# EAGLE schematic P1001-001-003-320 - Controller (EAGLE 9.4.2)

## Sheet 1 of 4
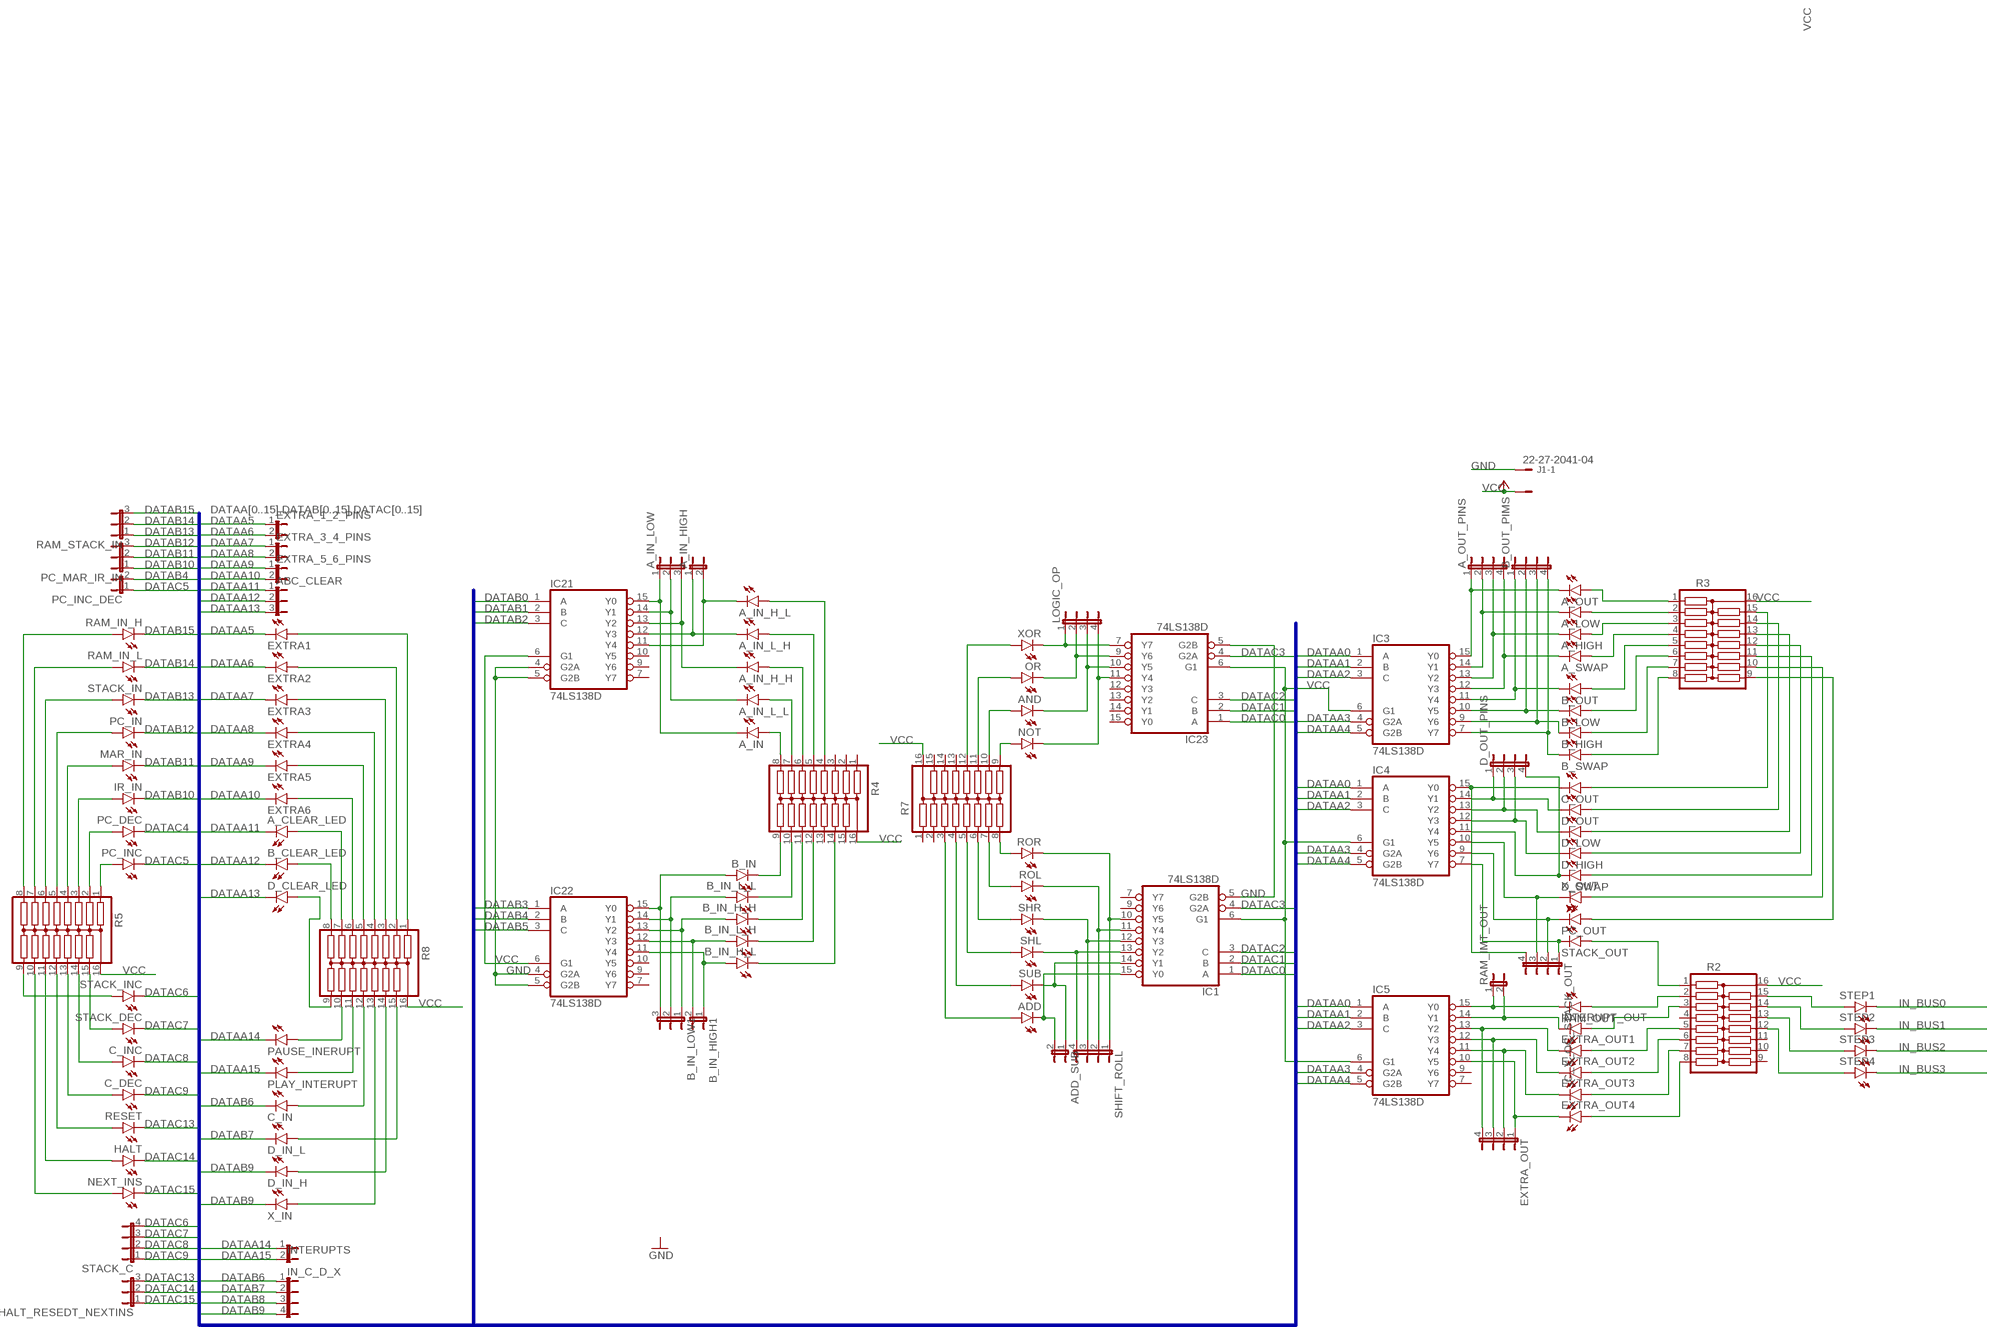
[diagram p0: schematic, sheet 1]

### Parts
A_CLEAR_LED  LEDSFH482  [SFH482]
A_HIGH  LEDSFH482  [SFH482]
A_IN  LEDSFH482  [SFH482]
A_IN_H_H  LEDSFH482  [SFH482]
A_IN_H_L  LEDSFH482  [SFH482]
A_IN_HIGH  JP1E  [JP1]
A_IN_L_H  LEDSFH482  [SFH482]
A_IN_L_L  LEDSFH482  [SFH482]
A_IN_LOW  JP2W  [JP2W]
A_LOW  LEDSFH482  [SFH482]
A_OUT  LEDSFH482  [SFH482]
A_OUT_PINS  JP4E  [JP4]
A_SWAP  LEDSFH482  [SFH482]
ABC_CLEAR  JP2W  [JP2W]
ADD  LEDSFH482  [SFH482]
ADD_SUB  JP1E  [JP1]
AND  LEDSFH482  [SFH482]
B_CLEAR_LED  LEDSFH482  [SFH482]
B_HIGH  LEDSFH482  [SFH482]
B_IN  LEDSFH482  [SFH482]
B_IN_H_H  LEDSFH482  [SFH482]
B_IN_H_L  LEDSFH482  [SFH482]
B_IN_HIGH1  JP1E  [JP1]
B_IN_L_H  LEDSFH482  [SFH482]
B_IN_L_L  LEDSFH482  [SFH482]
B_IN_LOW1  JP2W  [JP2W]
B_LOW  LEDSFH482  [SFH482]
B_OUT  LEDSFH482  [SFH482]
B_OUT_PIMS  JP4E  [JP4]
B_SWAP  LEDSFH482  [SFH482]
C_DEC  LEDSFH482  [SFH482]
C_IN  LEDSFH482  [SFH482]
C_INC  LEDSFH482  [SFH482]
C_OUT  LEDSFH482  [SFH482]
C_X_OC_STACK_OUT  JP4E  [JP4]
D_CLEAR_LED  LEDSFH482  [SFH482]
D_HIGH  LEDSFH482  [SFH482]
D_IN_H  LEDSFH482  [SFH482]
D_IN_L  LEDSFH482  [SFH482]
D_LOW  LEDSFH482  [SFH482]
D_OUT  LEDSFH482  [SFH482]
D_OUT_PINS  JP4E  [JP4]
D_SWAP  LEDSFH482  [SFH482]
EXTRA1  LEDSFH482  [SFH482]
EXTRA2  LEDSFH482  [SFH482]
EXTRA3  LEDSFH482  [SFH482]
EXTRA4  LEDSFH482  [SFH482]
EXTRA5  LEDSFH482  [SFH482]
EXTRA6  LEDSFH482  [SFH482]
EXTRA_1_2_PINS  JP1E  [JP1]
EXTRA_3_4_PINS  JP1E  [JP1]
EXTRA_5_6_PINS  JP1E  [JP1]
EXTRA_OUT  JP4E  [JP4]
EXTRA_OUT1  LEDSFH482  [SFH482]
EXTRA_OUT2  LEDSFH482  [SFH482]
EXTRA_OUT3  LEDSFH482  [SFH482]
EXTRA_OUT4  LEDSFH482  [SFH482]
HALT  LEDSFH482  [SFH482]
HALT_RESEDT_NEXTINS  JP2W  [JP2W]
IC1  74LS138D  [SO16]
IC3  74LS138D  [SO16]
IC4  74LS138D  [SO16]
IC5  74LS138D  [SO16]
IC21  74LS138D  [SO16]
IC22  74LS138D  [SO16]
IC23  74LS138D  [SO16]
IN_C_D_X  JP4E  [JP4]
INTERUPT_OUT  LEDSFH482  [SFH482]
INTERUPTS  JP1E  [JP1]
IR_IN  LEDSFH482  [SFH482]
J1  22-27-2041-04  [6410-04]
LOGIC_OP  JP4E  [JP4]
MAR_IN  LEDSFH482  [SFH482]
NEXT_INS  LEDSFH482  [SFH482]
NOT  LEDSFH482  [SFH482]
OR  LEDSFH482  [SFH482]
PAUSE_INERUPT  LEDSFH482  [SFH482]
PC_DEC  LEDSFH482  [SFH482]
PC_IN  LEDSFH482  [SFH482]
PC_INC  LEDSFH482  [SFH482]
PC_INC_DEC  JP1E  [JP1]
PC_MAR_IR_IN  JP2W  [JP2W]
PC_OUT  LEDSFH482  [SFH482]
PLAY_INTERUPT  LEDSFH482  [SFH482]
R2  2NBS16-15  [SO16]
R3  2NBS16-15  [SO16]
R4  2NBS16-15  [SO16]
R5  2NBS16-15  [SO16]
R7  2NBS16-15  [SO16]
R8  2NBS16-15  [SO16]
RAM_IMT_OUT  JP1E  [JP1]
RAM_IN_H  LEDSFH482  [SFH482]
RAM_IN_L  LEDSFH482  [SFH482]
RAM_OUT  LEDSFH482  [SFH482]
RAM_STACK_IN  JP2W  [JP2W]
RESET  LEDSFH482  [SFH482]
ROL  LEDSFH482  [SFH482]
ROR  LEDSFH482  [SFH482]
SHIFT_ROLL  JP4E  [JP4]
SHL  LEDSFH482  [SFH482]
SHR  LEDSFH482  [SFH482]
STACK_C  JP4E  [JP4]
STACK_DEC  LEDSFH482  [SFH482]
STACK_IN  LEDSFH482  [SFH482]
STACK_INC  LEDSFH482  [SFH482]
STACK_OUT  LEDSFH482  [SFH482]
STEP1  LEDSFH482  [SFH482]
STEP2  LEDSFH482  [SFH482]
STEP3  LEDSFH482  [SFH482]
STEP4  LEDSFH482  [SFH482]
SUB  LEDSFH482  [SFH482]
X_IN  LEDSFH482  [SFH482]
X_OUT  LEDSFH482  [SFH482]
XOR  LEDSFH482  [SFH482]

### Nets
DATAA0: IC3.1(A) IC4.1(A) IC5.1(A) ; also sheet 2,3
DATAA1: IC3.2(B) IC4.2(B) IC5.2(B) ; also sheet 2,3
DATAA2: IC3.3(C) IC4.3(C) IC5.3(C) ; also sheet 2,3
DATAA3: IC3.4(G2A) IC4.4(G2A) IC5.4(G2A) ; also sheet 2,3
DATAA4: IC3.5(G2B) IC4.5(G2B) IC5.5(G2B) ; also sheet 2,3
DATAA5: EXTRA1.K(C) EXTRA_1_2_PINS.1 ; also sheet 2,3
DATAA6: EXTRA2.K(C) EXTRA_1_2_PINS.2 ; also sheet 2,3
DATAA7: EXTRA3.K(C) EXTRA_3_4_PINS.1 ; also sheet 2,3
DATAA8: EXTRA4.K(C) EXTRA_3_4_PINS.2 ; also sheet 2,3
DATAA9: EXTRA5.K(C) EXTRA_5_6_PINS.1 ; also sheet 2,3
DATAA10: EXTRA6.K(C) EXTRA_5_6_PINS.2 ; also sheet 2,3
DATAA11: A_CLEAR_LED.K(C) ABC_CLEAR.1 ; also sheet 2,3
DATAA12: ABC_CLEAR.2 B_CLEAR_LED.K(C) ; also sheet 2,3
DATAA13: ABC_CLEAR.3 D_CLEAR_LED.K(C) ; also sheet 2,3
DATAA14: INTERUPTS.1 PAUSE_INERUPT.K(C) ; also sheet 2,3
DATAA15: INTERUPTS.2 PLAY_INTERUPT.K(C) ; also sheet 2,3
DATAB0: IC21.1(A) ; also sheet 2,3
DATAB1: IC21.2(B) ; also sheet 2,3
DATAB2: IC21.3(C) ; also sheet 2,3
DATAB3: IC22.1(A) ; also sheet 2,3
DATAB4: IC22.2(B) PC_INC_DEC.2 ; also sheet 2,3
DATAB5: IC22.3(C) ; also sheet 2,3
DATAB6: C_IN.K(C) IN_C_D_X.1 ; also sheet 2,3
DATAB7: D_IN_L.K(C) IN_C_D_X.2 ; also sheet 2,3
DATAB8: D_IN_H.K(C) IN_C_D_X.3 ; also sheet 2,3
DATAB9: IN_C_D_X.4 X_IN.K(C) ; also sheet 2,3
DATAB10: IR_IN.K(C) PC_MAR_IR_IN.1 ; also sheet 2,3
DATAB11: MAR_IN.K(C) PC_MAR_IR_IN.2 ; also sheet 2,3
DATAB12: PC_IN.K(C) PC_MAR_IR_IN.3 ; also sheet 2,3
DATAB13: RAM_STACK_IN.1 STACK_IN.K(C) ; also sheet 2,3
DATAB14: RAM_IN_L.K(C) RAM_STACK_IN.2 ; also sheet 2,3
DATAB15: RAM_IN_H.K(C) RAM_STACK_IN.3 ; also sheet 2,3
DATAC0: IC1.1(A) IC23.1(A) ; also sheet 2,3
DATAC1: IC1.2(B) IC23.2(B) ; also sheet 2,3
DATAC2: IC1.3(C) IC23.3(C) ; also sheet 2,3
DATAC3: IC1.4(G2A) IC23.4(G2A) ; also sheet 2,3
DATAC4: PC_DEC.K(C) ; also sheet 2,3
DATAC5: PC_INC.K(C) PC_INC_DEC.1 ; also sheet 2,3
DATAC6: STACK_C.4 STACK_INC.K(C) ; also sheet 2,3
DATAC7: STACK_C.3 STACK_DEC.K(C) ; also sheet 2,3
DATAC8: C_INC.K(C) STACK_C.2 ; also sheet 2,3
DATAC9: C_DEC.K(C) STACK_C.1 ; also sheet 2,3
DATAC13: HALT_RESEDT_NEXTINS.3 RESET.K(C) ; also sheet 2,3
DATAC14: HALT.K(C) HALT_RESEDT_NEXTINS.2 ; also sheet 2,3
DATAC15: HALT_RESEDT_NEXTINS.1 NEXT_INS.K(C) ; also sheet 2,3
GND [power]: IC1.5(G2B) IC21.4(G2A) IC21.5(G2B) IC22.4(G2A) IC22.5(G2B) IC23.5(G2B) J1.1 ; also sheet 2,3,4
IN_BUS0: STEP1.K(C) ; also sheet 2,3
IN_BUS1: STEP2.K(C) ; also sheet 2,3
IN_BUS2: STEP3.K(C) ; also sheet 2,3
IN_BUS3: STEP4.K(C) ; also sheet 2,3
N$2: EXTRA1.A R8.1
N$3: EXTRA2.A R8.2
N$4: R8.13 X_IN.A
N$5: EXTRA4.A R8.4
N$6: EXTRA3.A R8.3
N$7: EXTRA6.A R8.6
N$8: B_CLEAR_LED.A R8.8
N$9: A_CLEAR_LED.A R8.7
N$10: D_CLEAR_LED.A R8.9
N$11: PAUSE_INERUPT.A R8.10
N$12: PLAY_INTERUPT.A R8.11
N$13: C_IN.A R8.12
N$14: D_IN_L.A R8.15
N$15: D_IN_H.A R8.14
N$16: PC_INC.A R5.1
N$17: PC_DEC.A R5.2
N$18: IR_IN.A R5.3
N$19: MAR_IN.A R5.4
N$20: PC_IN.A R5.5
N$21: R5.6 STACK_IN.A
N$22: R5.7 RAM_IN_L.A
N$23: R5.8 RAM_IN_H.A
N$24: NEXT_INS.A R5.10
N$25: R5.15 STACK_DEC.A
N$26: C_INC.A R5.14
N$27: C_DEC.A R5.13
N$28: R5.12 RESET.A
N$29: HALT.A R5.11
N$30: R5.9 STACK_INC.A
N$31: A_IN.K(C) A_IN_LOW.1 IC21.15(Y0)
N$32: A_IN_L_L.K(C) A_IN_LOW.2 IC21.14(Y1)
N$33: A_IN_H_H.K(C) A_IN_LOW.3 IC21.13(Y2)
N$34: A_IN_HIGH.1 A_IN_L_H.K(C) IC21.12(Y3)
N$35: A_IN_H_L.K(C) A_IN_HIGH.2 IC21.11(Y4)
N$36: A_IN.A R4.8
N$38: A_IN_L_L.A R4.7
N$39: A_IN_H_H.A R4.6
N$40: A_IN_L_H.A R4.5
N$41: A_IN_H_L.A R4.4
N$43: EXTRA5.A R8.5
N$44: B_IN.A B_IN_LOW1.3 IC22.15(Y0)
N$45: B_IN_L_L.A B_IN_LOW1.2 IC22.14(Y1)
N$46: B_IN_H_H.A B_IN_LOW1.1 IC22.13(Y2)
N$47: B_IN_HIGH1.2 B_IN_L_H.A IC22.12(Y3)
N$48: B_IN_H_L.A B_IN_HIGH1.1 IC22.11(Y4)
N$49: B_IN.K(C) R4.9
N$51: B_IN_L_L.K(C) R4.10
N$52: B_IN_H_H.K(C) R4.11
N$53: B_IN_L_H.K(C) R4.12
N$54: B_IN_H_L.K(C) R4.14
N$55: R7.8 ROR.A
N$56: R7.7 ROL.A
N$57: R7.6 SHR.A
N$58: R7.5 SHL.A
N$59: R7.4 SUB.A
N$60: ADD.A R7.3
N$61: ADD.K(C) ADD_SUB.2 IC1.15(Y0)
N$62: ADD_SUB.1 IC1.14(Y1) SUB.K(C)
N$63: IC1.13(Y2) SHIFT_ROLL.4 SHL.K(C)
N$64: IC1.12(Y3) SHIFT_ROLL.3 SHR.K(C)
N$65: IC1.11(Y4) ROL.K(C) SHIFT_ROLL.2
N$66: IC1.10(Y5) ROR.K(C) SHIFT_ROLL.1
N$67: NOT.A R7.9
N$68: AND.A R7.10
N$69: OR.A R7.11
N$70: R7.12 XOR.A
N$71: IC23.7(Y7) LOGIC_OP.1 XOR.K(C)
N$72: IC23.9(Y6) LOGIC_OP.2 OR.K(C)
N$73: AND.K(C) IC23.10(Y5) LOGIC_OP.3
N$74: IC23.11(Y4) LOGIC_OP.4 NOT.K(C)
N$75: A_OUT.K(C) A_OUT_PINS.1 IC3.15(Y0)
N$76: A_LOW.K(C) A_OUT_PINS.2 IC3.14(Y1)
N$77: A_HIGH.K(C) A_OUT_PINS.3 IC3.13(Y2)
N$78: A_OUT_PINS.4 A_SWAP.K(C) IC3.12(Y3)
N$79: B_OUT.K(C) B_OUT_PIMS.1 IC3.11(Y4)
N$80: B_LOW.K(C) B_OUT_PIMS.2 IC3.10(Y5)
N$81: B_HIGH.K(C) B_OUT_PIMS.3 IC3.9(Y6)
N$82: B_OUT_PIMS.4 B_SWAP.K(C) IC3.7(Y7)
N$83: D_OUT.K(C) D_OUT_PINS.1 IC4.14(Y1)
N$84: C_OUT.K(C) C_X_OC_STACK_OUT.4 IC4.15(Y0)
N$85: D_LOW.K(C) D_OUT_PINS.2 IC4.13(Y2)
N$86: D_HIGH.K(C) D_OUT_PINS.3 IC4.12(Y3)
N$87: D_OUT_PINS.4 D_SWAP.K(C) IC4.11(Y4)
N$88: C_X_OC_STACK_OUT.3 IC4.10(Y5) X_OUT.K(C)
N$89: C_X_OC_STACK_OUT.2 IC4.9(Y6) PC_OUT.K(C)
N$90: C_X_OC_STACK_OUT.1 IC4.7(Y7) STACK_OUT.K(C)
N$91: A_OUT.A R3.1
N$92: A_LOW.A R3.2
N$93: A_HIGH.A R3.3
N$94: A_SWAP.A R3.4
N$95: B_OUT.A R3.5
N$96: B_LOW.A R3.6
N$97: B_HIGH.A R3.7
N$98: B_SWAP.A R3.8
N$99: C_OUT.A R3.15
N$100: D_OUT.A R3.14
N$101: D_LOW.A R3.13
N$102: D_HIGH.A R3.12
N$103: D_SWAP.A R3.11
N$104: R3.10 X_OUT.A
N$105: PC_OUT.A R3.9
N$106: IC5.15(Y0) RAM_IMT_OUT.1 RAM_OUT.K(C)
N$107: IC5.14(Y1) INTERUPT_OUT.K(C) RAM_IMT_OUT.2
N$108: EXTRA_OUT1.K(C) EXTRA_OUT.4 IC5.13(Y2)
N$109: EXTRA_OUT2.K(C) EXTRA_OUT.3 IC5.12(Y3)
N$110: EXTRA_OUT3.K(C) EXTRA_OUT.2 IC5.11(Y4)
N$111: EXTRA_OUT4.K(C) EXTRA_OUT.1 IC5.10(Y5)
N$112: R2.1 STACK_OUT.A
N$113: EXTRA_OUT4.A R2.8
N$114: EXTRA_OUT3.A R2.7
N$115: EXTRA_OUT2.A R2.6
N$116: EXTRA_OUT1.A R2.5
N$117: R2.2 RAM_OUT.A
N$118: INTERUPT_OUT.A R2.3
N$131: R2.15 STEP1.A
N$132: R2.14 STEP2.A
N$133: R2.13 STEP3.A
N$134: R2.12 STEP4.A
VCC [power]: IC1.6(G1) IC3.6(G1) IC4.6(G1) IC5.6(G1) IC21.6(G1) IC22.6(G1) IC23.6(G1) J1.2 R2.16 R3.16 R4.16 R5.16 R7.16 R8.16 ; also sheet 2,3,4
Unconnected: IC1.7(Y7) IC1.9(Y6) IC5.7(Y7) IC5.9(Y6) IC21.7(Y7) IC21.9(Y6) IC21.10(Y5) IC22.7(Y7) IC22.9(Y6) IC22.10(Y5) IC23.12(Y3) IC23.13(Y2) IC23.14(Y1) IC23.15(Y0) J1.3 J1.4 R2.4 R2.9 R2.10 R2.11 R4.1 R4.2 R4.3 R4.13 R4.15 R7.1 R7.2 R7.13 R7.14 R7.15

### Buses
DATAA[0..15],DATAB[0..15],DATAC[0..15]

## Sheet 2 of 4
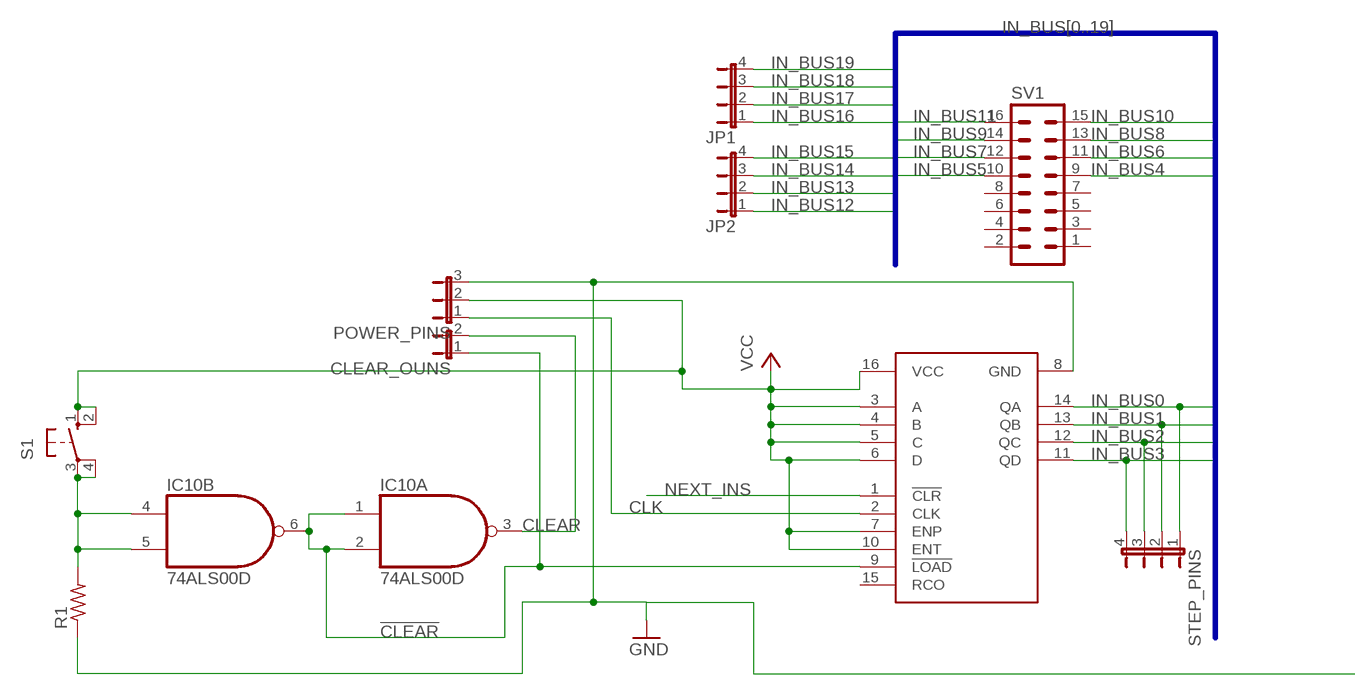
[diagram p1: schematic, sheet 2, part 1 of 2]
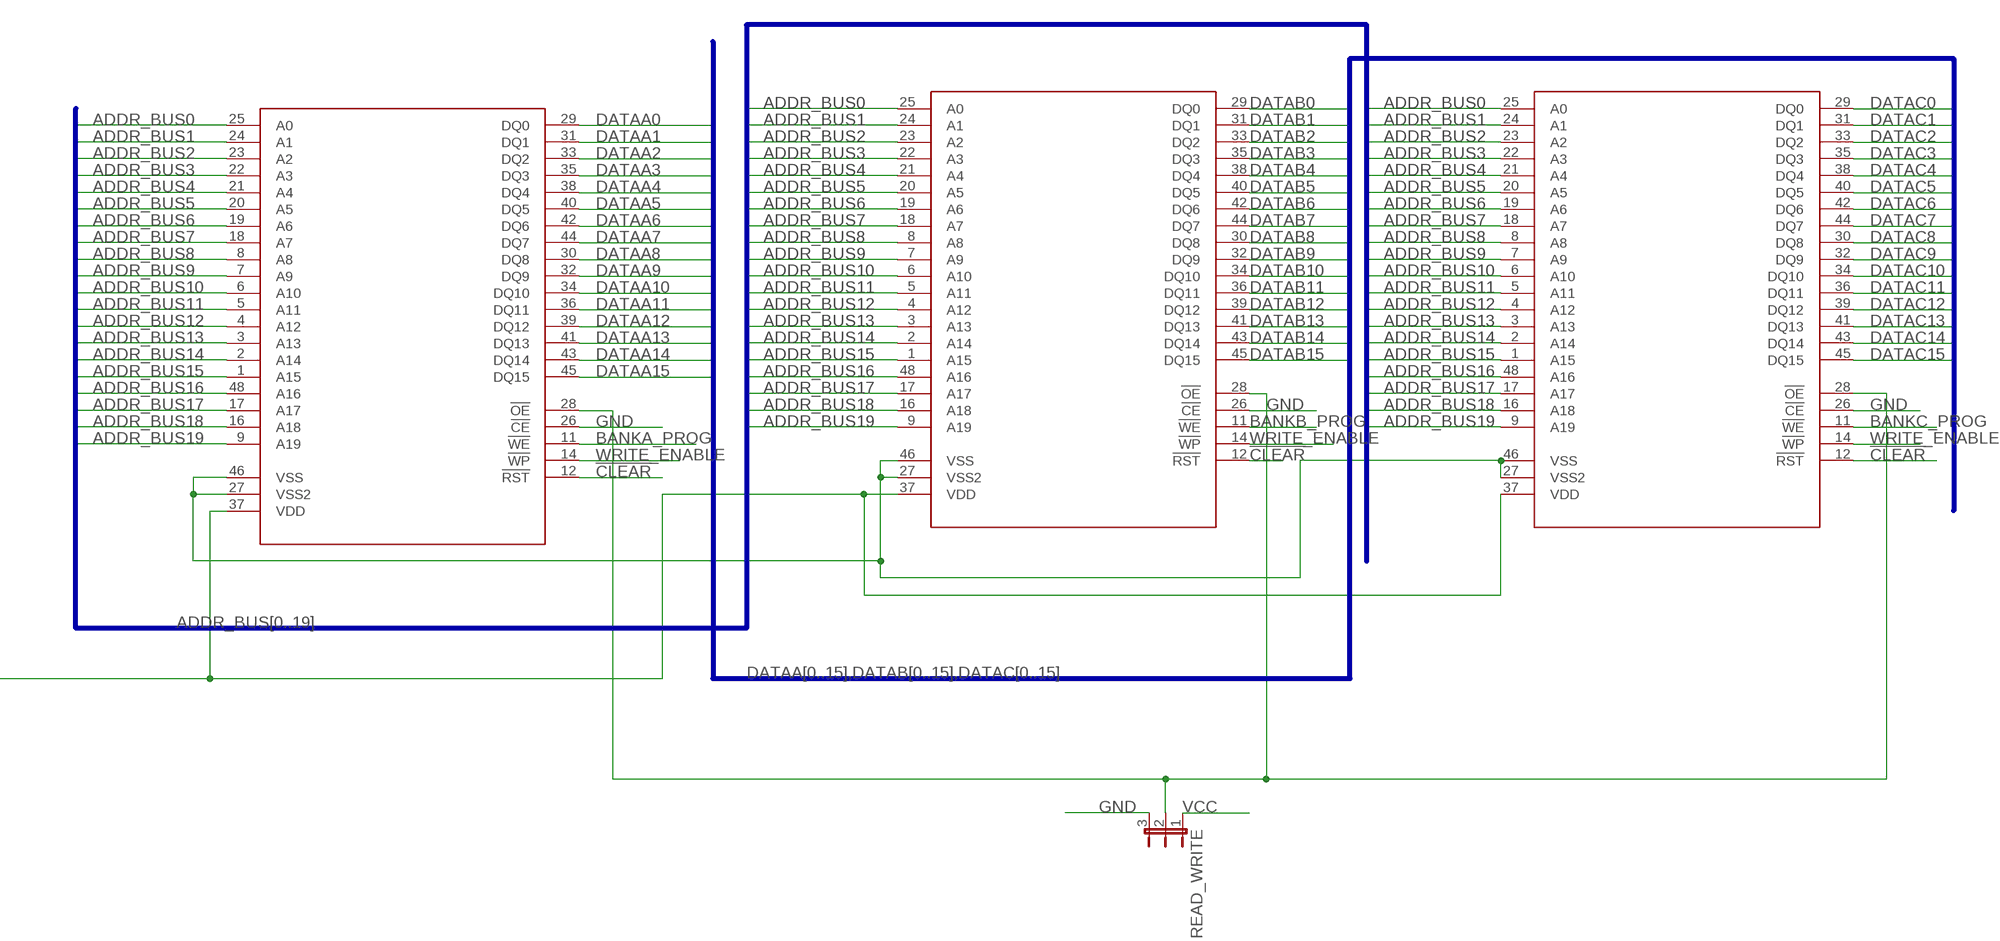
[diagram p2: schematic, sheet 2, part 2 of 2]

### Parts
BANKA  SST39VF1602-70-4I-EKE  [TSOP48]
BANKB  SST39VF1602-70-4I-EKE  [TSOP48]
BANKC  SST39VF1602-70-4I-EKE  [TSOP48]
CLEAR_OUNS  JP1E  [JP1]
IC10  74ALS00D  [SO14]
JP1  JP4E  [JP4]
JP2  JP4E  [JP4]
POWER_PINS  JP2E  [JP2]
R1  R-US_M0805  [M0805]
READ_WRITE  JP2E  [JP2]
S1  40-XX  [B3F-40XX]
STEP_PINS  JP4E  [JP4]
SV1  ML16  [ML16]
U$4  SN74HC161  [SO16]

### Nets
!CLEAR: BANKA.12(!RST) BANKB.12(!RST) BANKC.12(!RST) CLEAR_OUNS.1 IC10.1(A:I0) IC10.2(A:I1) IC10.6(B:O) U$4.9(!LOAD)
ADDR_BUS0: BANKA.25(A0) BANKB.25(A0) BANKC.25(A0) ; also sheet 3
ADDR_BUS1: BANKA.24(A1) BANKB.24(A1) BANKC.24(A1) ; also sheet 3
ADDR_BUS2: BANKA.23(A2) BANKB.23(A2) BANKC.23(A2) ; also sheet 3
ADDR_BUS3: BANKA.22(A3) BANKB.22(A3) BANKC.22(A3) ; also sheet 3
ADDR_BUS4: BANKA.21(A4) BANKB.21(A4) BANKC.21(A4) ; also sheet 3
ADDR_BUS5: BANKA.20(A5) BANKB.20(A5) BANKC.20(A5) ; also sheet 3
ADDR_BUS6: BANKA.19(A6) BANKB.19(A6) BANKC.19(A6) ; also sheet 3
ADDR_BUS7: BANKA.18(A7) BANKB.18(A7) BANKC.18(A7) ; also sheet 3
ADDR_BUS8: BANKA.8(A8) BANKB.8(A8) BANKC.8(A8) ; also sheet 3
ADDR_BUS9: BANKA.7(A9) BANKB.7(A9) BANKC.7(A9) ; also sheet 3
ADDR_BUS10: BANKA.6(A10) BANKB.6(A10) BANKC.6(A10) ; also sheet 3
ADDR_BUS11: BANKA.5(A11) BANKB.5(A11) BANKC.5(A11) ; also sheet 3
ADDR_BUS12: BANKA.4(A12) BANKB.4(A12) BANKC.4(A12) ; also sheet 3
ADDR_BUS13: BANKA.3(A13) BANKB.3(A13) BANKC.3(A13) ; also sheet 3
ADDR_BUS14: BANKA.2(A14) BANKB.2(A14) BANKC.2(A14) ; also sheet 3
ADDR_BUS15: BANKA.1(A15) BANKB.1(A15) BANKC.1(A15) ; also sheet 3
ADDR_BUS16: BANKA.48(A16) BANKB.48(A16) BANKC.48(A16) ; also sheet 3
ADDR_BUS17: BANKA.17(A17) BANKB.17(A17) BANKC.17(A17) ; also sheet 3
ADDR_BUS18: BANKA.16(A18) BANKB.16(A18) BANKC.16(A18) ; also sheet 3
ADDR_BUS19: BANKA.9(A19) BANKB.9(A19) BANKC.9(A19) ; also sheet 3
BANKA_PROG: BANKA.11(!WE) ; also sheet 3
BANKB_PROG: BANKB.11(!WE) ; also sheet 3
BANKC_PROG: BANKC.11(!WE) ; also sheet 3
CLEAR: CLEAR_OUNS.2 IC10.3(A:O)
CLK: POWER_PINS.1 U$4.2(CLK)
DATAA0: BANKA.29(DQ0) ; also sheet 1,3
DATAA1: BANKA.31(DQ1) ; also sheet 1,3
DATAA2: BANKA.33(DQ2) ; also sheet 1,3
DATAA3: BANKA.35(DQ3) ; also sheet 1,3
DATAA4: BANKA.38(DQ4) ; also sheet 1,3
DATAA5: BANKA.40(DQ5) ; also sheet 1,3
DATAA6: BANKA.42(DQ6) ; also sheet 1,3
DATAA7: BANKA.44(DQ7) ; also sheet 1,3
DATAA8: BANKA.30(DQ8) ; also sheet 1,3
DATAA9: BANKA.32(DQ9) ; also sheet 1,3
DATAA10: BANKA.34(DQ10) ; also sheet 1,3
DATAA11: BANKA.36(DQ11) ; also sheet 1,3
DATAA12: BANKA.39(DQ12) ; also sheet 1,3
DATAA13: BANKA.41(DQ13) ; also sheet 1,3
DATAA14: BANKA.43(DQ14) ; also sheet 1,3
DATAA15: BANKA.45(DQ15) ; also sheet 1,3
DATAB0: BANKB.29(DQ0) ; also sheet 1,3
DATAB1: BANKB.31(DQ1) ; also sheet 1,3
DATAB2: BANKB.33(DQ2) ; also sheet 1,3
DATAB3: BANKB.35(DQ3) ; also sheet 1,3
DATAB4: BANKB.38(DQ4) ; also sheet 1,3
DATAB5: BANKB.40(DQ5) ; also sheet 1,3
DATAB6: BANKB.42(DQ6) ; also sheet 1,3
DATAB7: BANKB.44(DQ7) ; also sheet 1,3
DATAB8: BANKB.30(DQ8) ; also sheet 1,3
DATAB9: BANKB.32(DQ9) ; also sheet 1,3
DATAB10: BANKB.34(DQ10) ; also sheet 1,3
DATAB11: BANKB.36(DQ11) ; also sheet 1,3
DATAB12: BANKB.39(DQ12) ; also sheet 1,3
DATAB13: BANKB.41(DQ13) ; also sheet 1,3
DATAB14: BANKB.43(DQ14) ; also sheet 1,3
DATAB15: BANKB.45(DQ15) ; also sheet 1,3
DATAC0: BANKC.29(DQ0) ; also sheet 1,3
DATAC1: BANKC.31(DQ1) ; also sheet 1,3
DATAC2: BANKC.33(DQ2) ; also sheet 1,3
DATAC3: BANKC.35(DQ3) ; also sheet 1,3
DATAC4: BANKC.38(DQ4) ; also sheet 1,3
DATAC5: BANKC.40(DQ5) ; also sheet 1,3
DATAC6: BANKC.42(DQ6) ; also sheet 1,3
DATAC7: BANKC.44(DQ7) ; also sheet 1,3
DATAC8: BANKC.30(DQ8) ; also sheet 1,3
DATAC9: BANKC.32(DQ9) ; also sheet 1,3
DATAC10: BANKC.34(DQ10) ; also sheet 3
DATAC11: BANKC.36(DQ11) ; also sheet 3
DATAC12: BANKC.39(DQ12) ; also sheet 3
DATAC13: BANKC.41(DQ13) ; also sheet 1,3
DATAC14: BANKC.43(DQ14) ; also sheet 1,3
DATAC15: BANKC.45(DQ15) ; also sheet 1,3
GND [power]: BANKA.26(!CE) BANKA.37(VDD) BANKB.26(!CE) BANKB.37(VDD) BANKC.26(!CE) BANKC.37(VDD) POWER_PINS.3 R1.1 READ_WRITE.3 U$4.8(GND) ; also sheet 1,3,4
IN_BUS0: STEP_PINS.1 U$4.14(QA) ; also sheet 1,3
IN_BUS1: STEP_PINS.2 U$4.13(QB) ; also sheet 1,3
IN_BUS2: STEP_PINS.3 U$4.12(QC) ; also sheet 1,3
IN_BUS3: STEP_PINS.4 U$4.11(QD) ; also sheet 1,3
IN_BUS4: SV1.9 ; also sheet 3
IN_BUS5: SV1.10 ; also sheet 3
IN_BUS6: SV1.11 ; also sheet 3
IN_BUS7: SV1.12 ; also sheet 3
IN_BUS8: SV1.13 ; also sheet 3
IN_BUS9: SV1.14 ; also sheet 3
IN_BUS10: SV1.15 ; also sheet 3
IN_BUS11: SV1.16 ; also sheet 3
IN_BUS12: JP2.1 ; also sheet 3
IN_BUS13: JP2.2 ; also sheet 3
IN_BUS14: JP2.3 ; also sheet 3
IN_BUS15: JP2.4 ; also sheet 3
IN_BUS16: JP1.1 ; also sheet 3
IN_BUS17: JP1.2 ; also sheet 3
IN_BUS18: JP1.3 ; also sheet 3
IN_BUS19: JP1.4 ; also sheet 3
N$1: IC10.4(B:I0) IC10.5(B:I1) R1.2 S1.3(P) S1.4(P1)
N$37: BANKA.27(VSS2) BANKA.46(VSS) BANKB.27(VSS2) BANKB.46(VSS) BANKC.27(VSS2) BANKC.46(VSS)
N$42: BANKA.28(!OE) BANKB.28(!OE) BANKC.28(!OE) READ_WRITE.2
NEXT_INS: U$4.1(!CLR)
VCC [power]: POWER_PINS.2 READ_WRITE.1 S1.1(S) S1.2(S1) U$4.3(A) U$4.4(B) U$4.5(C) U$4.6(D) U$4.7(ENP) U$4.10(ENT) U$4.16(VCC) ; also sheet 1,3,4
WRITE_ENABLE: BANKA.14(!WP) BANKB.14(!WP) BANKC.14(!WP) ; also sheet 3
Unconnected: IC10.8(C:O) IC10.9(C:I0) IC10.10(C:I1) IC10.11(D:O) IC10.12(D:I0) IC10.13(D:I1) SV1.1 SV1.2 SV1.3 SV1.4 SV1.5 SV1.6 SV1.7 SV1.8 U$4.15(RCO)

### Buses
IN_BUS[0..19]
ADDR_BUS[0..19]
DATAA[0..15],DATAB[0..15],DATAC[0..15]

## Sheet 3 of 4
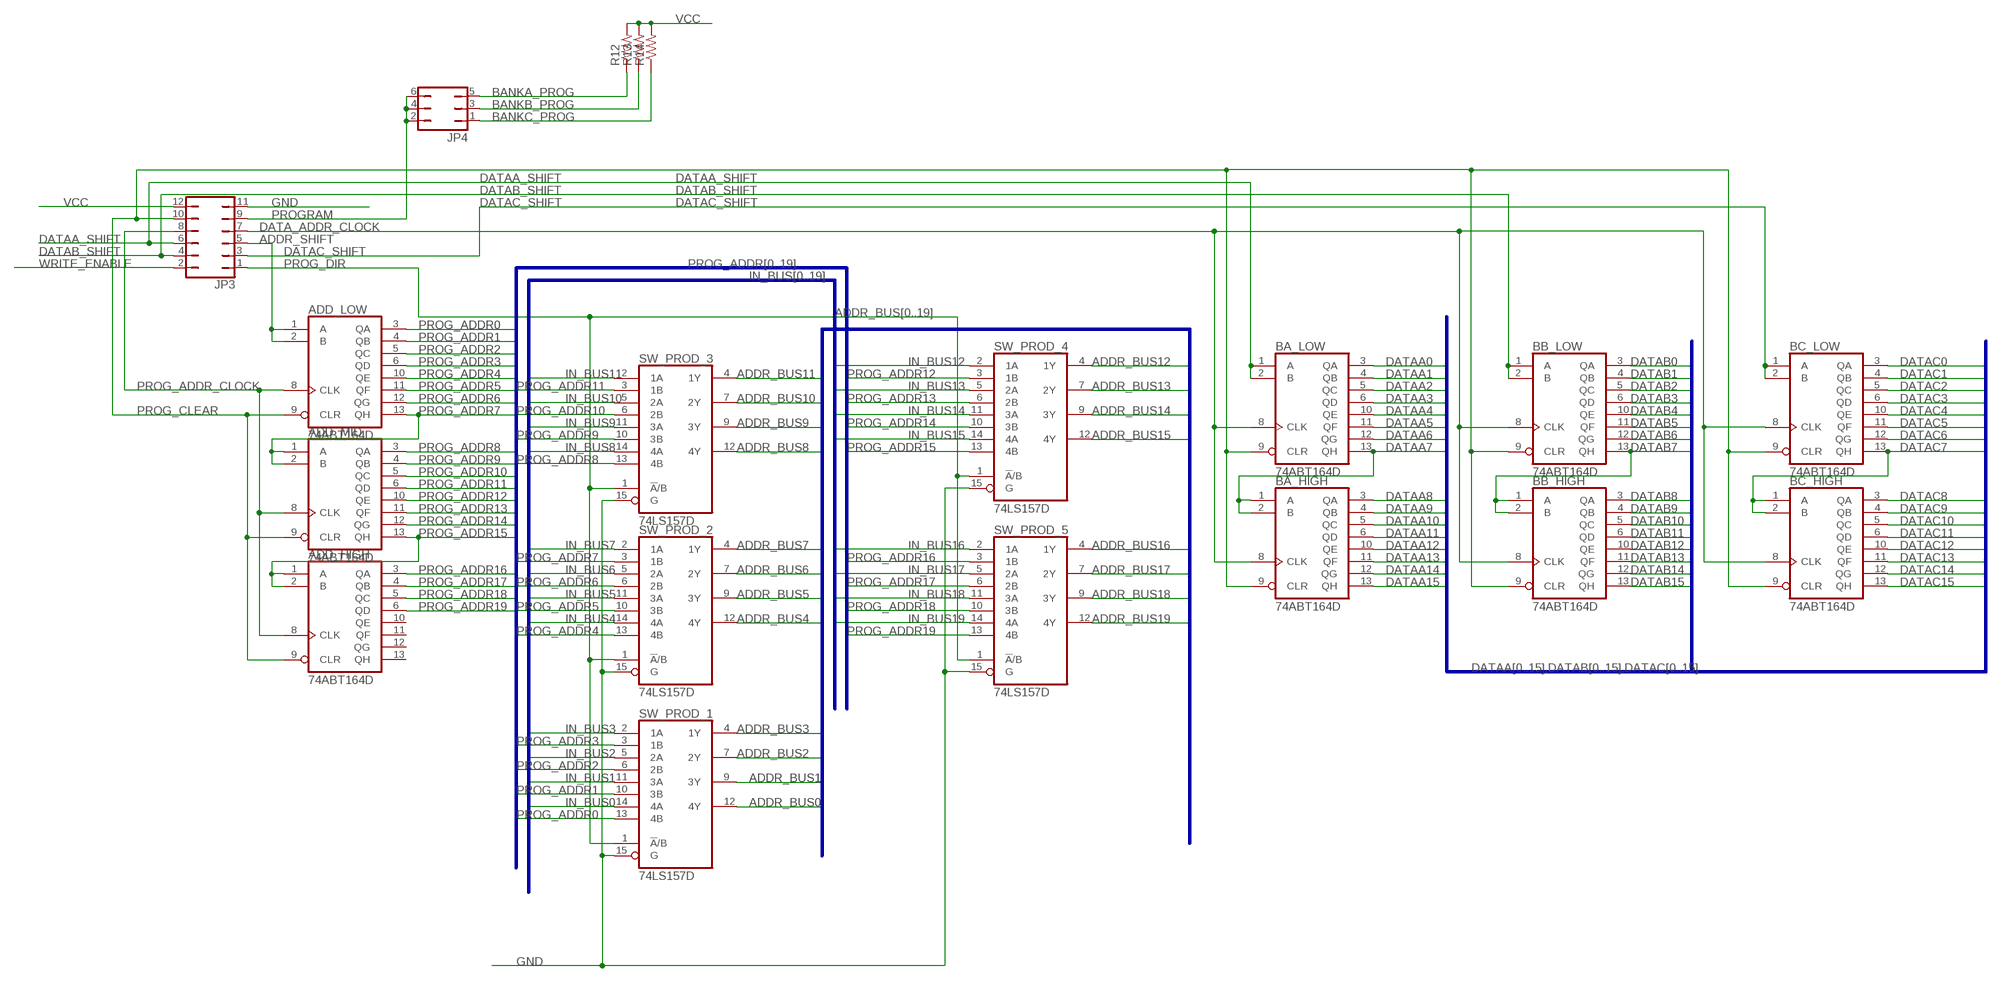
[diagram p3: schematic, sheet 3]

### Parts
ADD_HIGH  74ABT164D  [SO14]
ADD_LOW  74ABT164D  [SO14]
ADD_MID  74ABT164D  [SO14]
BA_HIGH  74ABT164D  [SO14]
BA_LOW  74ABT164D  [SO14]
BB_HIGH  74ABT164D  [SO14]
BB_LOW  74ABT164D  [SO14]
BC_HIGH  74ABT164D  [SO14]
BC_LOW  74ABT164D  [SO14]
JP3  JP6Q  [JP6Q]
JP4  JP3Q  [JP3Q]
R12  R-US_M0805  [M0805]
R13  R-US_M0805  [M0805]
R14  R-US_M0805  [M0805]
SW_PROD_1  74LS157D  [SO16]
SW_PROD_2  74LS157D  [SO16]
SW_PROD_3  74LS157D  [SO16]
SW_PROD_4  74LS157D  [SO16]
SW_PROD_5  74LS157D  [SO16]

### Nets
ADDR_BUS0: SW_PROD_1.12(4Y) ; also sheet 2
ADDR_BUS1: SW_PROD_1.9(3Y) ; also sheet 2
ADDR_BUS2: SW_PROD_1.7(2Y) ; also sheet 2
ADDR_BUS3: SW_PROD_1.4(1Y) ; also sheet 2
ADDR_BUS4: SW_PROD_2.12(4Y) ; also sheet 2
ADDR_BUS5: SW_PROD_2.9(3Y) ; also sheet 2
ADDR_BUS6: SW_PROD_2.7(2Y) ; also sheet 2
ADDR_BUS7: SW_PROD_2.4(1Y) ; also sheet 2
ADDR_BUS8: SW_PROD_3.12(4Y) ; also sheet 2
ADDR_BUS9: SW_PROD_3.9(3Y) ; also sheet 2
ADDR_BUS10: SW_PROD_3.7(2Y) ; also sheet 2
ADDR_BUS11: SW_PROD_3.4(1Y) ; also sheet 2
ADDR_BUS12: SW_PROD_4.4(1Y) ; also sheet 2
ADDR_BUS13: SW_PROD_4.7(2Y) ; also sheet 2
ADDR_BUS14: SW_PROD_4.9(3Y) ; also sheet 2
ADDR_BUS15: SW_PROD_4.12(4Y) ; also sheet 2
ADDR_BUS16: SW_PROD_5.4(1Y) ; also sheet 2
ADDR_BUS17: SW_PROD_5.7(2Y) ; also sheet 2
ADDR_BUS18: SW_PROD_5.9(3Y) ; also sheet 2
ADDR_BUS19: SW_PROD_5.12(4Y) ; also sheet 2
ADDR_SHIFT: ADD_LOW.1(A) ADD_LOW.2(B) JP3.5
BANKA_PROG: JP4.5 R12.1 ; also sheet 2
BANKB_PROG: JP4.3 R13.1 ; also sheet 2
BANKC_PROG: JP4.1 R14.1 ; also sheet 2
DATA_ADDR_CLOCK: BA_HIGH.8(CLK) BA_LOW.8(CLK) BB_HIGH.8(CLK) BB_LOW.8(CLK) BC_HIGH.8(CLK) BC_LOW.8(CLK) JP3.7
DATAA0: BA_LOW.3(QA) ; also sheet 1,2
DATAA1: BA_LOW.4(QB) ; also sheet 1,2
DATAA2: BA_LOW.5(QC) ; also sheet 1,2
DATAA3: BA_LOW.6(QD) ; also sheet 1,2
DATAA4: BA_LOW.10(QE) ; also sheet 1,2
DATAA5: BA_LOW.11(QF) ; also sheet 1,2
DATAA6: BA_LOW.12(QG) ; also sheet 1,2
DATAA7: BA_HIGH.1(A) BA_HIGH.2(B) BA_LOW.13(QH) ; also sheet 1,2
DATAA8: BA_HIGH.3(QA) ; also sheet 1,2
DATAA9: BA_HIGH.4(QB) ; also sheet 1,2
DATAA10: BA_HIGH.5(QC) ; also sheet 1,2
DATAA11: BA_HIGH.6(QD) ; also sheet 1,2
DATAA12: BA_HIGH.10(QE) ; also sheet 1,2
DATAA13: BA_HIGH.11(QF) ; also sheet 1,2
DATAA14: BA_HIGH.12(QG) ; also sheet 1,2
DATAA15: BA_HIGH.13(QH) ; also sheet 1,2
DATAA_SHIFT: BA_LOW.1(A) BA_LOW.2(B) JP3.6
DATAB0: BB_LOW.3(QA) ; also sheet 1,2
DATAB1: BB_LOW.4(QB) ; also sheet 1,2
DATAB2: BB_LOW.5(QC) ; also sheet 1,2
DATAB3: BB_LOW.6(QD) ; also sheet 1,2
DATAB4: BB_LOW.10(QE) ; also sheet 1,2
DATAB5: BB_LOW.11(QF) ; also sheet 1,2
DATAB6: BB_LOW.12(QG) ; also sheet 1,2
DATAB7: BB_HIGH.1(A) BB_HIGH.2(B) BB_LOW.13(QH) ; also sheet 1,2
DATAB8: BB_HIGH.3(QA) ; also sheet 1,2
DATAB9: BB_HIGH.4(QB) ; also sheet 1,2
DATAB10: BB_HIGH.5(QC) ; also sheet 1,2
DATAB11: BB_HIGH.6(QD) ; also sheet 1,2
DATAB12: BB_HIGH.10(QE) ; also sheet 1,2
DATAB13: BB_HIGH.11(QF) ; also sheet 1,2
DATAB14: BB_HIGH.12(QG) ; also sheet 1,2
DATAB15: BB_HIGH.13(QH) ; also sheet 1,2
DATAB_SHIFT: BB_LOW.1(A) BB_LOW.2(B) JP3.4
DATAC0: BC_LOW.3(QA) ; also sheet 1,2
DATAC1: BC_LOW.4(QB) ; also sheet 1,2
DATAC2: BC_LOW.5(QC) ; also sheet 1,2
DATAC3: BC_LOW.6(QD) ; also sheet 1,2
DATAC4: BC_LOW.10(QE) ; also sheet 1,2
DATAC5: BC_LOW.11(QF) ; also sheet 1,2
DATAC6: BC_LOW.12(QG) ; also sheet 1,2
DATAC7: BC_HIGH.1(A) BC_HIGH.2(B) BC_LOW.13(QH) ; also sheet 1,2
DATAC8: BC_HIGH.3(QA) ; also sheet 1,2
DATAC9: BC_HIGH.4(QB) ; also sheet 1,2
DATAC10: BC_HIGH.5(QC) ; also sheet 2
DATAC11: BC_HIGH.6(QD) ; also sheet 2
DATAC12: BC_HIGH.10(QE) ; also sheet 2
DATAC13: BC_HIGH.11(QF) ; also sheet 1,2
DATAC14: BC_HIGH.12(QG) ; also sheet 1,2
DATAC15: BC_HIGH.13(QH) ; also sheet 1,2
DATAC_SHIFT: BC_LOW.1(A) BC_LOW.2(B) JP3.3
GND [power]: JP3.11 SW_PROD_1.15(G) SW_PROD_2.15(G) SW_PROD_3.15(G) SW_PROD_4.15(G) SW_PROD_5.15(G) ; also sheet 1,2,4
IN_BUS0: SW_PROD_1.14(4A) ; also sheet 1,2
IN_BUS1: SW_PROD_1.11(3A) ; also sheet 1,2
IN_BUS2: SW_PROD_1.5(2A) ; also sheet 1,2
IN_BUS3: SW_PROD_1.2(1A) ; also sheet 1,2
IN_BUS4: SW_PROD_2.14(4A) ; also sheet 2
IN_BUS5: SW_PROD_2.11(3A) ; also sheet 2
IN_BUS6: SW_PROD_2.5(2A) ; also sheet 2
IN_BUS7: SW_PROD_2.2(1A) ; also sheet 2
IN_BUS8: SW_PROD_3.14(4A) ; also sheet 2
IN_BUS9: SW_PROD_3.11(3A) ; also sheet 2
IN_BUS10: SW_PROD_3.5(2A) ; also sheet 2
IN_BUS11: SW_PROD_3.2(1A) ; also sheet 2
IN_BUS12: SW_PROD_4.2(1A) ; also sheet 2
IN_BUS13: SW_PROD_4.5(2A) ; also sheet 2
IN_BUS14: SW_PROD_4.11(3A) ; also sheet 2
IN_BUS15: SW_PROD_4.14(4A) ; also sheet 2
IN_BUS16: SW_PROD_5.2(1A) ; also sheet 2
IN_BUS17: SW_PROD_5.5(2A) ; also sheet 2
IN_BUS18: SW_PROD_5.11(3A) ; also sheet 2
IN_BUS19: SW_PROD_5.14(4A) ; also sheet 2
PROG_ADDR0: ADD_LOW.3(QA) SW_PROD_1.13(4B)
PROG_ADDR1: ADD_LOW.4(QB) SW_PROD_1.10(3B)
PROG_ADDR2: ADD_LOW.5(QC) SW_PROD_1.6(2B)
PROG_ADDR3: ADD_LOW.6(QD) SW_PROD_1.3(1B)
PROG_ADDR4: ADD_LOW.10(QE) SW_PROD_2.13(4B)
PROG_ADDR5: ADD_LOW.11(QF) SW_PROD_2.10(3B)
PROG_ADDR6: ADD_LOW.12(QG) SW_PROD_2.6(2B)
PROG_ADDR7: ADD_LOW.13(QH) ADD_MID.1(A) ADD_MID.2(B) SW_PROD_2.3(1B)
PROG_ADDR8: ADD_MID.3(QA) SW_PROD_3.13(4B)
PROG_ADDR9: ADD_MID.4(QB) SW_PROD_3.10(3B)
PROG_ADDR10: ADD_MID.5(QC) SW_PROD_3.6(2B)
PROG_ADDR11: ADD_MID.6(QD) SW_PROD_3.3(1B)
PROG_ADDR12: ADD_MID.10(QE) SW_PROD_4.3(1B)
PROG_ADDR13: ADD_MID.11(QF) SW_PROD_4.6(2B)
PROG_ADDR14: ADD_MID.12(QG) SW_PROD_4.10(3B)
PROG_ADDR15: ADD_HIGH.1(A) ADD_HIGH.2(B) ADD_MID.13(QH) SW_PROD_4.13(4B)
PROG_ADDR16: ADD_HIGH.3(QA) SW_PROD_5.3(1B)
PROG_ADDR17: ADD_HIGH.4(QB) SW_PROD_5.6(2B)
PROG_ADDR18: ADD_HIGH.5(QC) SW_PROD_5.10(3B)
PROG_ADDR19: ADD_HIGH.6(QD) SW_PROD_5.13(4B)
PROG_ADDR_CLOCK: ADD_HIGH.8(CLK) ADD_LOW.8(CLK) ADD_MID.8(CLK) JP3.8
PROG_CLEAR: ADD_HIGH.9(CLR) ADD_LOW.9(CLR) ADD_MID.9(CLR) BA_HIGH.9(CLR) BA_LOW.9(CLR) BB_HIGH.9(CLR) BB_LOW.9(CLR) BC_HIGH.9(CLR) BC_LOW.9(CLR) JP3.10
PROG_DIR: JP3.1 SW_PROD_1.1(!A!/B) SW_PROD_2.1(!A!/B) SW_PROD_3.1(!A!/B) SW_PROD_4.1(!A!/B) SW_PROD_5.1(!A!/B)
PROGRAM: JP3.9 JP4.2 JP4.4 JP4.6
VCC [power]: JP3.12 R12.2 R13.2 R14.2 ; also sheet 1,2,4
WRITE_ENABLE: JP3.2 ; also sheet 2
Unconnected: ADD_HIGH.10(QE) ADD_HIGH.11(QF) ADD_HIGH.12(QG) ADD_HIGH.13(QH)

### Buses
ADDR_BUS[0..19]
IN_BUS[0..19]
PROG_ADDR[0..19]
DATAA[0..15],DATAB[0..15],DATAC[0..15]

## Sheet 4 of 4
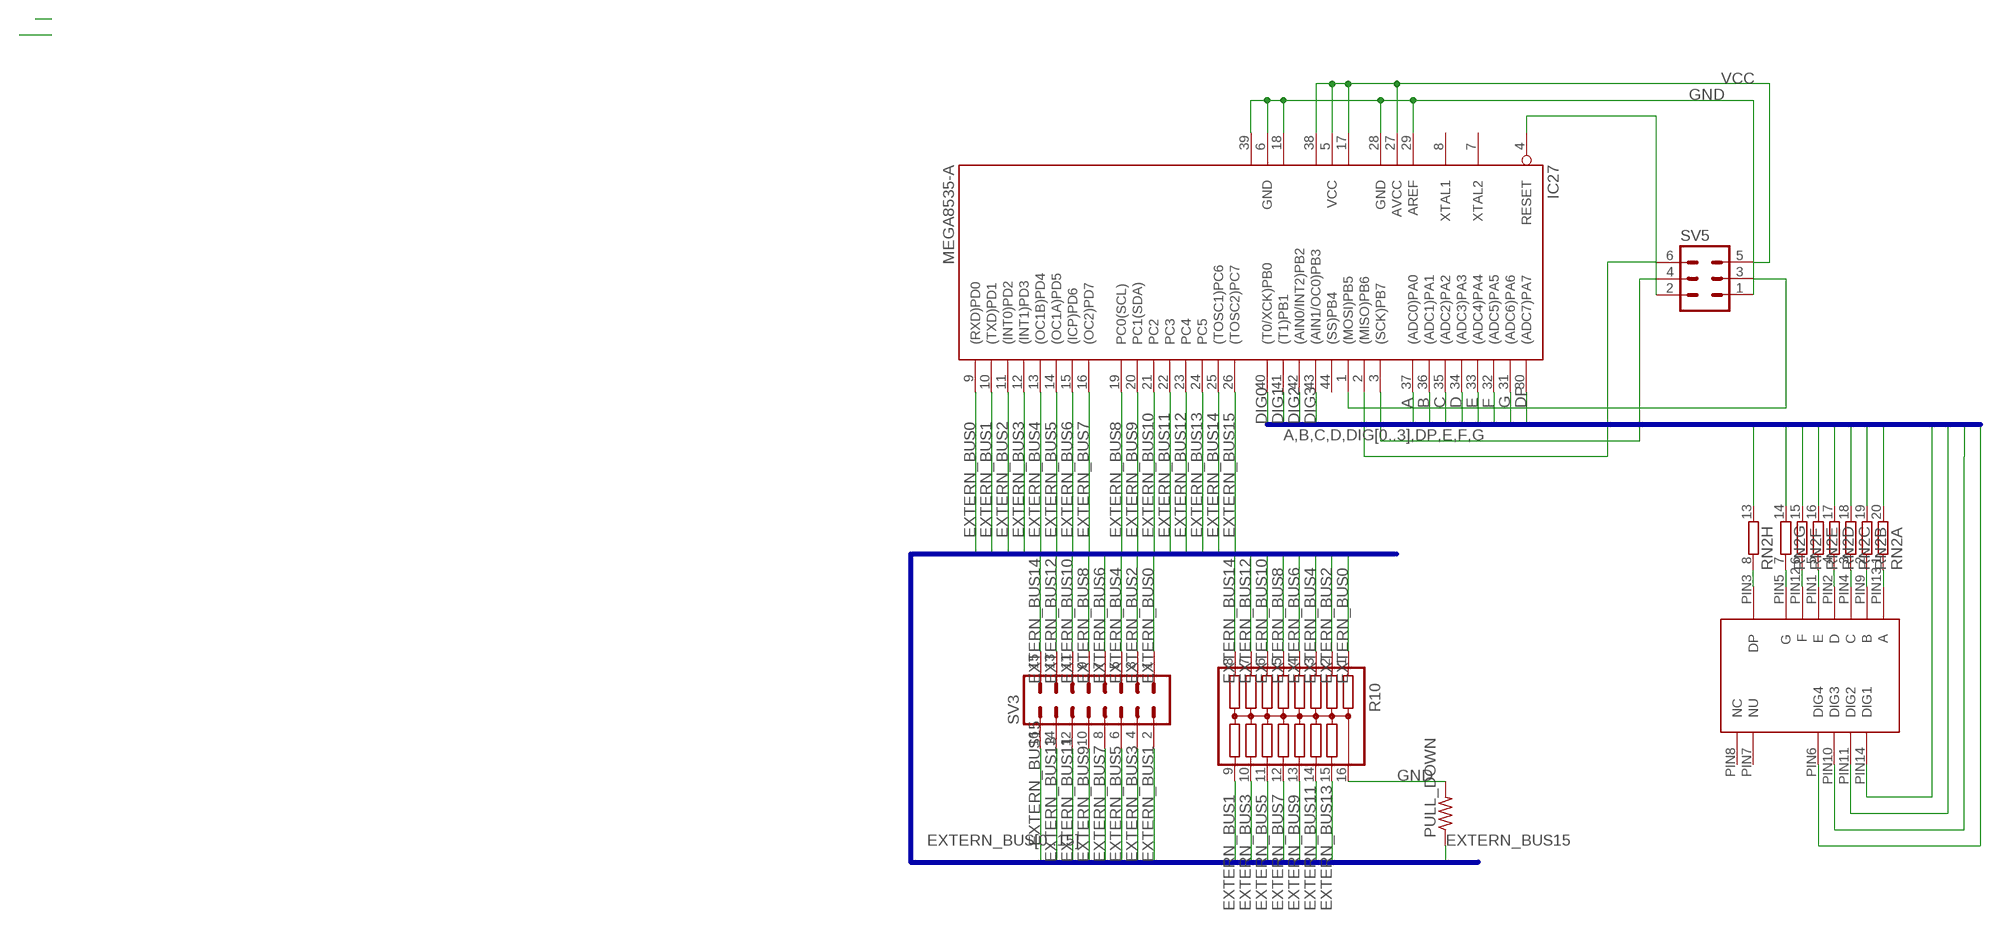
[diagram p4: schematic, sheet 4]

### Parts
IC27  MEGA8535-A  [TQFP44]
PULL_DOWN  R-US_M0805  [M0805]
R10  2NBS16-15  [SO16]
RN2  10R-NSOMC  [SOMC20]
SV3  ML16  [ML16]
SV5  ML6  [ML6]
U$1  4-DIGIT-7-SEGMENT  [4-DIGIT-7-SEGMENT]

### Nets
A: IC27.37((ADC0)PA0) RN2.20
B: IC27.36((ADC1)PA1) RN2.19
C: IC27.35((ADC2)PA2) RN2.18
D: IC27.34((ADC3)PA3) RN2.17
DIG0: IC27.40((T0/XCK)PB0) U$1.PIN14(DIG1)
DIG1: IC27.41((T1)PB1) U$1.PIN11(DIG2)
DIG2: IC27.42((AIN0/INT2)PB2) U$1.PIN10(DIG3)
DIG3: IC27.43((AIN1/OC0)PB3) U$1.PIN6(DIG4)
DP: IC27.30((ADC7)PA7) RN2.13
E: IC27.33((ADC4)PA4) RN2.16
EXTERN_BUS0: IC27.9((RXD)PD0) R10.1 SV3.1
EXTERN_BUS1: IC27.10((TXD)PD1) R10.9 SV3.2
EXTERN_BUS2: IC27.11((INT0)PD2) R10.2 SV3.3
EXTERN_BUS3: IC27.12((INT1)PD3) R10.10 SV3.4
EXTERN_BUS4: IC27.13((OC1B)PD4) R10.3 SV3.5
EXTERN_BUS5: IC27.14((OC1A)PD5) R10.11 SV3.6
EXTERN_BUS6: IC27.15((ICP)PD6) R10.4 SV3.7
EXTERN_BUS7: IC27.16((OC2)PD7) R10.12 SV3.8
EXTERN_BUS8: IC27.19(PC0(SCL)) R10.5 SV3.9
EXTERN_BUS9: IC27.20(PC1(SDA)) R10.13 SV3.10
EXTERN_BUS10: IC27.21(PC2) R10.6 SV3.11
EXTERN_BUS11: IC27.22(PC3) R10.14 SV3.12
EXTERN_BUS12: IC27.23(PC4) R10.7 SV3.13
EXTERN_BUS13: IC27.24(PC5) R10.15 SV3.14
EXTERN_BUS14: IC27.25((TOSC1)PC6) R10.8 SV3.15
EXTERN_BUS15: IC27.26((TOSC2)PC7) PULL_DOWN.1 SV3.16
F: IC27.32((ADC5)PA5) RN2.15
G: IC27.31((ADC6)PA6) RN2.14
GND [power]: IC27.6(GND) IC27.18(GND1) IC27.28(GND) IC27.29(AREF) IC27.39(GND2) PULL_DOWN.2 R10.16 SV5.1 ; also sheet 1,2,3
N$119: IC27.1((MOSI)PB5) SV5.3
N$120: IC27.3((SCK)PB7) SV5.4
N$121: IC27.2((MISO)PB6) SV5.6
N$122: IC27.4(RESET) SV5.2
N$123: RN2.1 U$1.PIN13(A)
N$124: RN2.2 U$1.PIN9(B)
N$125: RN2.3 U$1.PIN4(C)
N$126: RN2.4 U$1.PIN2(D)
N$127: RN2.5 U$1.PIN1(E)
N$128: RN2.6 U$1.PIN12(F)
N$129: RN2.7 U$1.PIN5(G)
N$130: RN2.8 U$1.PIN3(DP)
VCC [power]: IC27.5(VCC) IC27.17(VCC1) IC27.27(AVCC) IC27.38(VCC2) SV5.5 ; also sheet 1,2,3
Unconnected: IC27.7(XTAL2) IC27.8(XTAL1) IC27.44((SS)PB4) RN2.9 RN2.10 RN2.11 RN2.12 U$1.PIN7(NU) U$1.PIN8(NC)

### Buses
A,B,C,D,DIG[0..3],DP,E,F,G
EXTERN_BUS[0..15]

## Power pins joined to a net without a drawn wire
GND: ADD_HIGH.7(GND) ADD_LOW.7(GND) ADD_MID.7(GND) BA_HIGH.7(GND) BA_LOW.7(GND) BB_HIGH.7(GND) BB_LOW.7(GND) BC_HIGH.7(GND) BC_LOW.7(GND) IC1.8(GND) IC3.8(GND) IC4.8(GND) IC5.8(GND) IC10.7(P:GND) IC21.8(GND) IC22.8(GND) IC23.8(GND) SW_PROD_1.8(GND) SW_PROD_2.8(GND) SW_PROD_3.8(GND) SW_PROD_4.8(GND) SW_PROD_5.8(GND)
VCC: ADD_HIGH.14(VCC) ADD_LOW.14(VCC) ADD_MID.14(VCC) BA_HIGH.14(VCC) BA_LOW.14(VCC) BB_HIGH.14(VCC) BB_LOW.14(VCC) BC_HIGH.14(VCC) BC_LOW.14(VCC) IC1.16(VCC) IC3.16(VCC) IC4.16(VCC) IC5.16(VCC) IC10.14(P:VCC) IC21.16(VCC) IC22.16(VCC) IC23.16(VCC) SW_PROD_1.16(VCC) SW_PROD_2.16(VCC) SW_PROD_3.16(VCC) SW_PROD_4.16(VCC) SW_PROD_5.16(VCC)

## Library data of the parts
A_CLEAR_LED A_HIGH A_IN A_IN_H_H A_IN_H_L A_IN_L_H A_IN_L_L A_LOW A_OUT A_SWAP ADD AND B_CLEAR_LED B_HIGH B_IN B_IN_H_H B_IN_H_L B_IN_L_H B_IN_L_L B_LOW B_OUT B_SWAP C_DEC C_IN C_INC C_OUT D_CLEAR_LED D_HIGH D_IN_H D_IN_L D_LOW D_OUT D_SWAP EXTRA1-EXTRA6 EXTRA_OUT1-EXTRA_OUT4 HALT INTERUPT_OUT IR_IN MAR_IN NEXT_INS NOT OR PAUSE_INERUPT PC_DEC PC_IN PC_INC PC_OUT PLAY_INTERUPT RAM_IN_H RAM_IN_L RAM_OUT RESET ROL ROR SHL SHR STACK_DEC STACK_IN STACK_INC STACK_OUT STEP1-STEP4 SUB X_IN X_OUT XOR = led:LED: LED OSRAM: - CHIPLED LG R971, LG N971, LY N971, LG Q971, LY Q971, LO R971, LY R971 LH N974, LH R974 LS Q976, LO Q976, LY Q976 LO Q996 - Hyper CHIPLED LW Q18S LB Q993, LB Q99A, LB R99A - SideLED LS A670, LO A670, LY A670, LG A670, LP A670 LB A673, LV A673, LT A673, LW A673 LH A674 LY A675 LS A676, LA A676, LO A676, LY A676, LW A676 LS A679, LY A679, LG A679 - Hyper Micro SIDELED® LS Y876, LA Y876, LO Y876, LY Y876 LT Y87S - SmartLED LW L88C, LW L88S LB L89C, LB L89S, LG L890 LS L89K, LO L89K, LY L89K LS L896, LA L896, LO L896, LY L896 - TOPLED LS T670, LO T670, LY T670, LG T670, LP T670 LSG T670, LSP T670, LSY T670, LOP T670, LYG T670 LG T671, LOG T671, LSG T671 LB T673, LV T673, LT T673, LW T673 LH T674 LS T676, LA T676, LO T676, LY T676, LB T676, LH T676, LSB T676, LW T676 LB T67C, LV T67C, LT T67C, LS T67K, LO T67K, LY T67K, LW E67C LS E67B, LA E67B, LO E67B, LY E67B, LB E67C, LV E67C, LT E67C LW T67C LS T679, LY T679, LG T679 LS T770, LO T770, LY T770, LG T770, LP T770 LB T773, LV T773, LT T773, LW T773 LH T774 LS E675, LA E675, LY E675, LS T675 LS T776, LA T776, LO T776, LY T776, LB T776 LHGB T686 LT T68C, LB T68C - Hyper Mini TOPLED® LB M676 - Mini TOPLED Santana® LG M470 LS M47K, LO M47K, LY M47K Source: http://www.osram.convergy.de LUXEON: - LUMILED® LXK2-PW12-R00, LXK2-PW12-S00, LXK2-PW14-U00, LXK2-PW14-V00 LXK2-PM12-R00, LXK2-PM12-S00, LXK2-PM14-U00 LXK2-PE12-Q00, LXK2-PE12-R00, LXK2-PE12-S00, LXK2-PE14-T00, LXK2-PE14-U00 LXK2-PB12-K00, LXK2-PB12-L00, LXK2-PB12-M00, LXK2-PB14-N00, LXK2-PB14-P00, LXK2-PB14-Q00 LXK2-PR12-L00, LXK2-PR12-M00, LXK2-PR14-Q00, LXK2-PR14-R00 LXK2-PD12-Q00, LXK2-PD12-R00, LXK2-PD12-S00 LXK2-PH12-R00, LXK2-PH12-S00 LXK2-PL12-P00, LXK2-PL12-Q00, LXK2-PL12-R00 Source: www.luxeon.com KINGBRIGHT: KA-3528ASYC Source: www.kingbright.com
A_IN_HIGH ADD_SUB B_IN_HIGH1 CLEAR_OUNS EXTRA_1_2_PINS EXTRA_3_4_PINS EXTRA_5_6_PINS INTERUPTS PC_INC_DEC RAM_IMT_OUT = jumper:JP1E: JUMPER
A_IN_LOW ABC_CLEAR B_IN_LOW1 HALT_RESEDT_NEXTINS PC_MAR_IR_IN RAM_STACK_IN = jumper:JP2W: JUMPER
A_OUT_PINS B_OUT_PIMS C_X_OC_STACK_OUT D_OUT_PINS EXTRA_OUT IN_C_D_X JP1 JP2 LOGIC_OP SHIFT_ROLL STACK_C STEP_PINS = jumper:JP4E: JUMPER
ADD_HIGH ADD_LOW ADD_MID BA_HIGH BA_LOW BB_HIGH BB_LOW BC_HIGH BC_LOW = 74xx-us:74*164: 8-bit parallel out SHIFT REGISTER
BANKA BANKB BANKC = 16bit:SST39VF1602-70-4I-EKE
IC1 IC3-IC5 IC21-IC23 = 74xx-us:74*138: 3-line to 8-line DECODER/DEMULTIPLEXER
IC10 = 74xx-us:74*00: Quad 2-input NAND gate
IC27 = atmel:MEGA8535: MICROCONTROLLER 8 Kbytes FLASH 512 bytes SRAM 512 bytes EEPROM USART 8-channel 10 bit ADC Source: avr.lbr; MPN: ATMEGA8535-16AU; OC_FARNELL: 1528437; OC_NEWARK: 01M6908
J1 = con-molex:22-?-04: CONNECTOR wire to board 2.54 mm (.1 inch) pitch header; MF: MOLEX; OC_FARNELL: unknown; OC_NEWARK: unknown
JP3 = jumper:JP6Q: JUMPER
JP4 = jumper:JP3Q: JUMPER
POWER_PINS READ_WRITE = jumper:JP2E: JUMPER
PULL_DOWN R1 R12-R14 = rcl:R-US_: RESISTOR, American symbol; SPICEPREFIX: R
R2-R5 R7 R8 R10 = resistor-bourns:2NBS16-15: BOURNS RESISTOR NETWORK; OC_FARNELL: unknown; OC_NEWARK: unknown
RN2 = resistor-dil:10R-N: DIL RESISTOR; OC_FARNELL: unknown; OC_NEWARK: unknown
S1 = switch-omron:40-XX: OMRON SWITCH; MF: OMRON COMPONENTS USA; MPN: B3F-4000; OC_FARNELL: 176434; OC_NEWARK: 36K3105
SV1 SV3 = con-harting-ml:ML16: HARTING; OC_FARNELL: unknown; OC_NEWARK: unknown
SV5 = con-harting-ml:ML6: HARTING; OC_FARNELL: unknown; OC_NEWARK: unknown
SW_PROD_1-SW_PROD_5 = 74xx-us:74*157: Quadruple 2-line to 1-line data SELECTOR/MULTIPLEXER
U$1 = ADAFRUIT:4-DIGIT-7-SEGMENT
U$4 = 16bit:SN74HC161

## Net classes
1 power: width 0.457 mm